# Altium schematic sheet PAGE 07-DIGITAL IO.SchDoc
size 416 x 264 mm; DocumentNumber: 7; SheetNumber: 7; PageSetup: Record=PageOptions|CenterHorizontal=True|CenterVertical=True|PrintScale=1.02|XCorrection=1.00|YCorrection=1.00|PrintKind=0|BorderSize=5000000|LeftOffset=0|BottomOffset=0|Orientation=2|PaperLength=1000|PaperWidth=1000|Scale=100|PaperSource=15|PrintQuality=600|MediaType=1|DitherType=10|PrintScaleMode=1|PaperKind=11x17|PaperIndex=17; Designer: Xuelu Li; DocumentFullPathAndName: //depot_np_hweng_boards/ung_hweng/UNG_8017_EVB-USB5926/
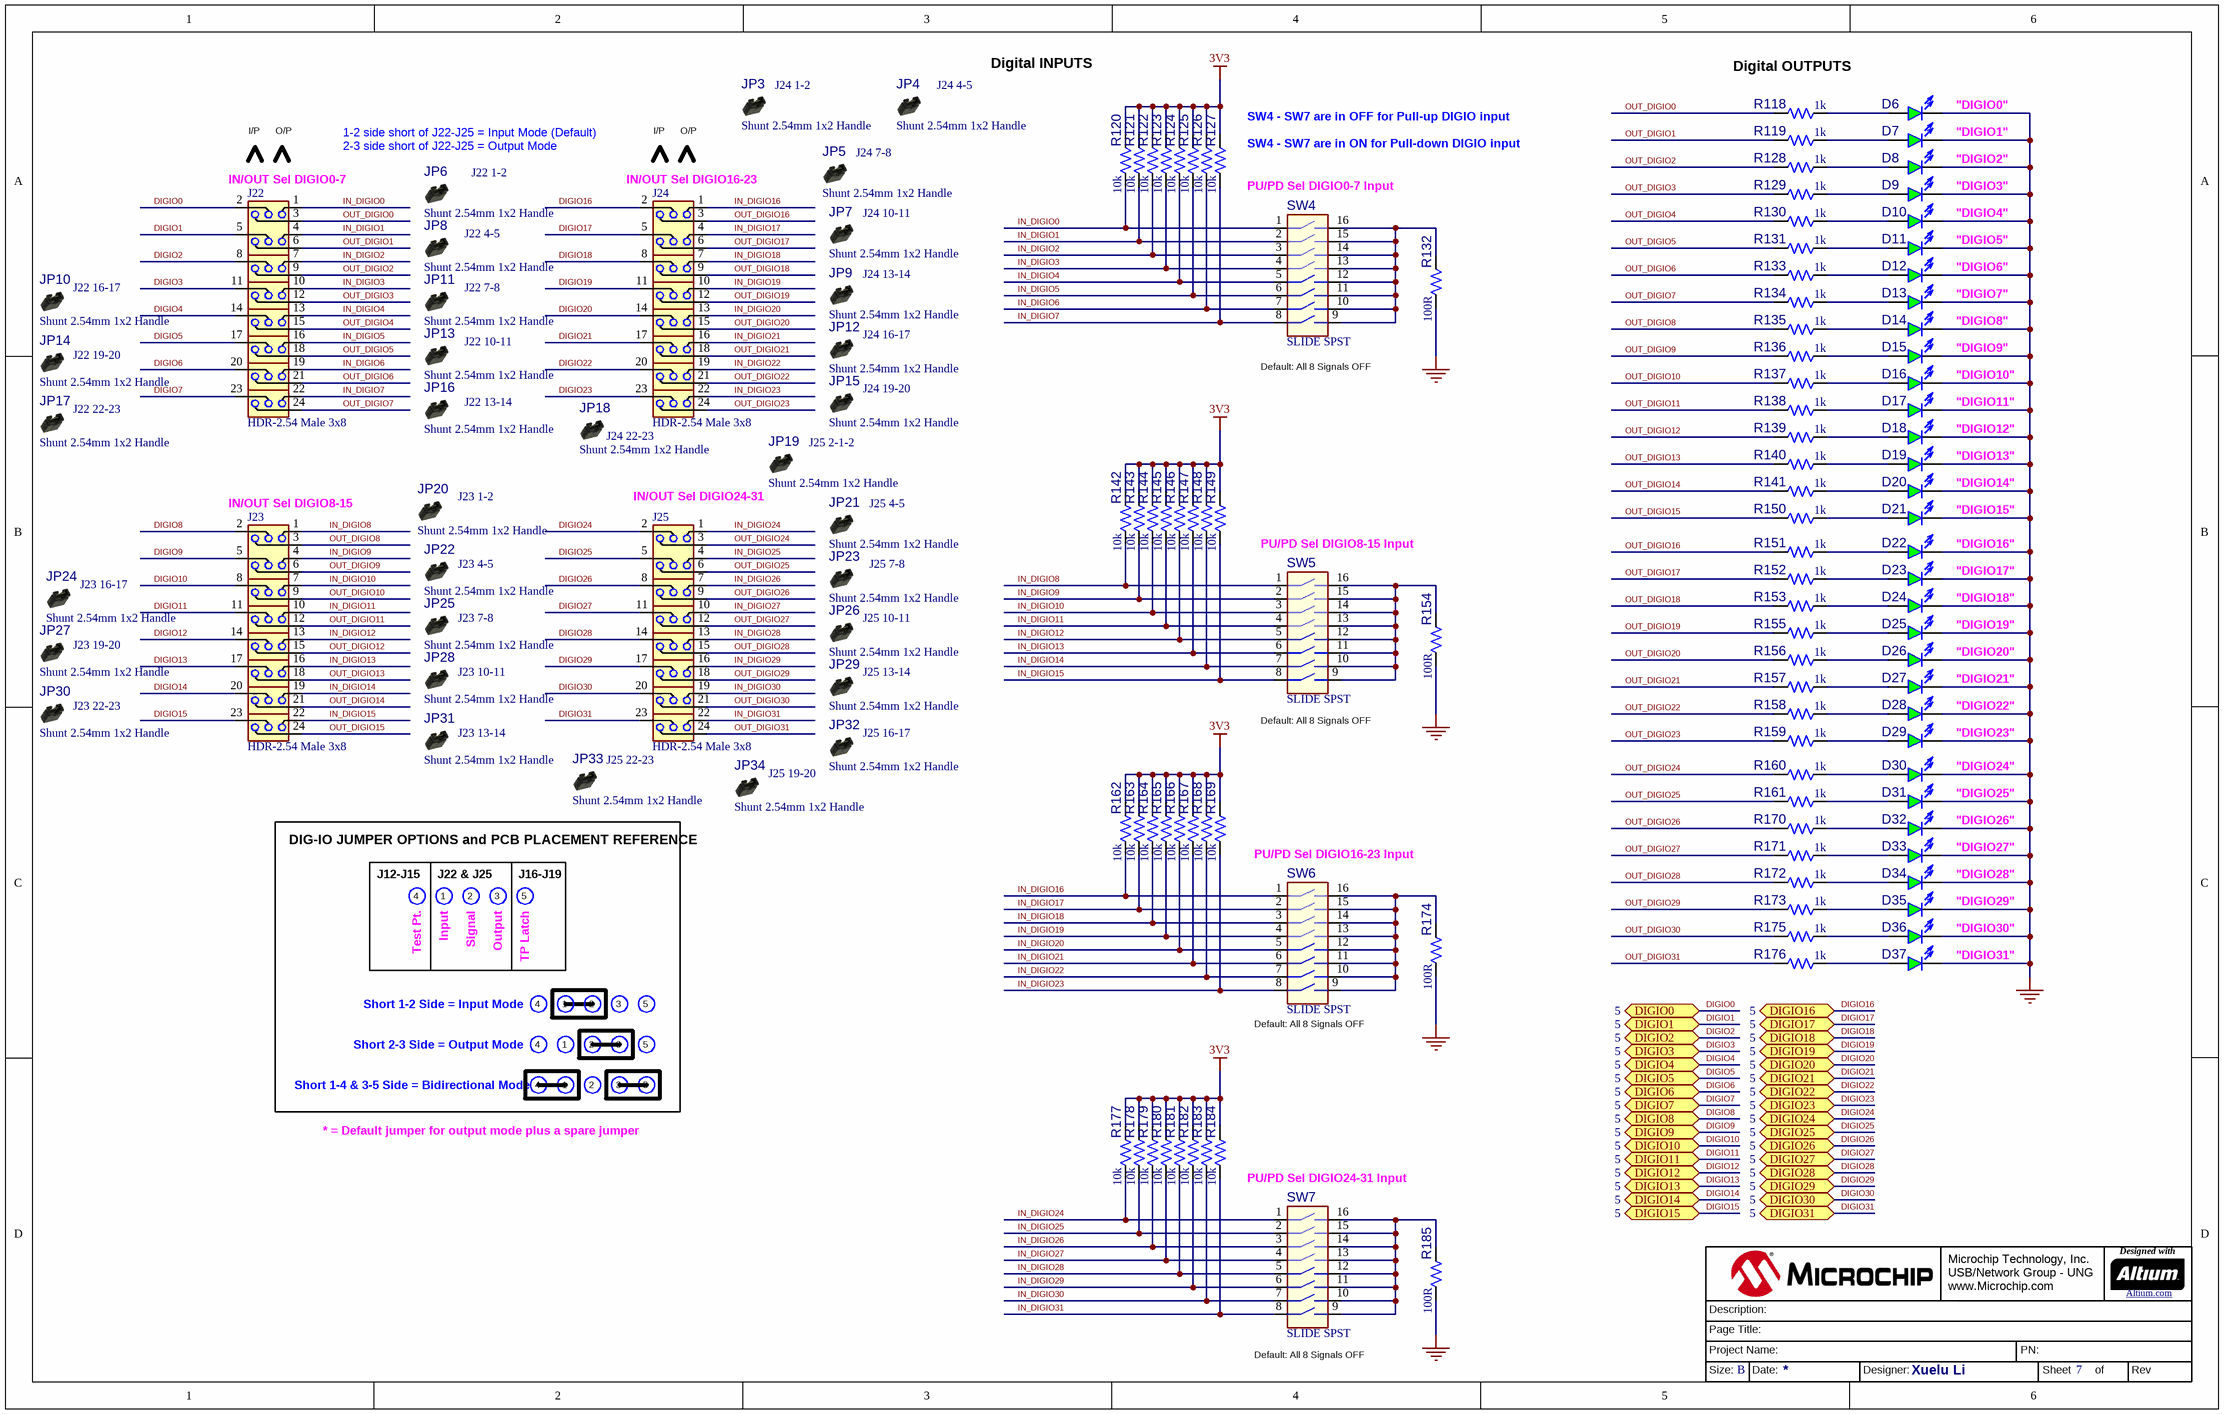
[diagram p0: PAGE 07-DIGITAL IO.SchDoc]

## Parts
?  (no value)  (graphical)
D6  LED_green  [LED_0603_GREEN]  (value not drawn)
D7  LED_green  [LED_0603_GREEN]  (value not drawn)
D8  LED_green  [LED_0603_GREEN]  (value not drawn)
D9  LED_green  [LED_0603_GREEN]  (value not drawn)
D10  LED_green  [LED_0603_GREEN]  (value not drawn)
D11  LED_green  [LED_0603_GREEN]  (value not drawn)
D12  LED_green  [LED_0603_GREEN]  (value not drawn)
D13  LED_green  [LED_0603_GREEN]  (value not drawn)
D14  LED_green  [LED_0603_GREEN]  (value not drawn)
D15  LED_green  [LED_0603_GREEN]  (value not drawn)
D16  LED_green  [LED_0603_GREEN]  (value not drawn)
D17  LED_green  [LED_0603_GREEN]  (value not drawn)
D18  LED_green  [LED_0603_GREEN]  (value not drawn)
D19  LED_green  [LED_0603_GREEN]  (value not drawn)
D20  LED_green  [LED_0603_GREEN]  (value not drawn)
D21  LED_green  [LED_0603_GREEN]  (value not drawn)
D22  LED_green  [LED_0603_GREEN]  (value not drawn)
D23  LED_green  [LED_0603_GREEN]  (value not drawn)
D24  LED_green  [LED_0603_GREEN]  (value not drawn)
D25  LED_green  [LED_0603_GREEN]  (value not drawn)
D26  LED_green  [LED_0603_GREEN]  (value not drawn)
D27  LED_green  [LED_0603_GREEN]  (value not drawn)
D28  LED_green  [LED_0603_GREEN]  (value not drawn)
D29  LED_green  [LED_0603_GREEN]  (value not drawn)
D30  LED_green  [LED_0603_GREEN]  (value not drawn)
D31  LED_green  [LED_0603_GREEN]  (value not drawn)
D32  LED_green  [LED_0603_GREEN]  (value not drawn)
D33  LED_green  [LED_0603_GREEN]  (value not drawn)
D34  LED_green  [LED_0603_GREEN]  (value not drawn)
D35  LED_green  [LED_0603_GREEN]  (value not drawn)
D36  LED_green  [LED_0603_GREEN]  (value not drawn)
D37  LED_green  [LED_0603_GREEN]  (value not drawn)
J22  value HDR-2.54 Male 3x8  [CON_HDR_2.54_3X8-shifted1]  (hidden comment: CON_HDR_2.54_3X8-shifted1)
J23  value HDR-2.54 Male 3x8  [CON_HDR_2.54_3X8-shifted1]  (hidden comment: CON_HDR_2.54_3X8-shifted1)
J24  value HDR-2.54 Male 3x8  [CON_HDR_2.54_3X8-shifted1]  (hidden comment: CON_HDR_2.54_3X8-shifted1)
J25  value HDR-2.54 Male 3x8  [CON_HDR_2.54_3X8-shifted1]  (hidden comment: CON_HDR_2.54_3X8-shifted1)
JP3  value Shunt 2.54mm 1x2 Handle  BOM Notes: J24 1-2  [Jumper_W_Handle_Mechanical]  (hidden comment: Jumper Mechanical)  (mechanical)
JP4  value Shunt 2.54mm 1x2 Handle  BOM Notes: J24 4-5  [Jumper_W_Handle_Mechanical]  (hidden comment: Jumper Mechanical)  (mechanical)
JP5  value Shunt 2.54mm 1x2 Handle  BOM Notes: J24 7-8  [Jumper_W_Handle_Mechanical]  (hidden comment: Jumper Mechanical)  (mechanical)
JP6  value Shunt 2.54mm 1x2 Handle  BOM Notes: J22 1-2  [Jumper_W_Handle_Mechanical]  (hidden comment: Jumper Mechanical)  (mechanical)
JP7  value Shunt 2.54mm 1x2 Handle  BOM Notes: J24 10-11  [Jumper_W_Handle_Mechanical]  (hidden comment: Jumper Mechanical)  (mechanical)
JP8  value Shunt 2.54mm 1x2 Handle  BOM Notes: J22 4-5  [Jumper_W_Handle_Mechanical]  (hidden comment: Jumper Mechanical)  (mechanical)
JP9  value Shunt 2.54mm 1x2 Handle  BOM Notes: J24 13-14  [Jumper_W_Handle_Mechanical]  (hidden comment: Jumper Mechanical)  (mechanical)
JP10  value Shunt 2.54mm 1x2 Handle  BOM Notes: J22 16-17  [Jumper_W_Handle_Mechanical]  (hidden comment: Jumper Mechanical)  (mechanical)
JP11  value Shunt 2.54mm 1x2 Handle  BOM Notes: J22 7-8  [Jumper_W_Handle_Mechanical]  (hidden comment: Jumper Mechanical)  (mechanical)
JP12  value Shunt 2.54mm 1x2 Handle  BOM Notes: J24 16-17  [Jumper_W_Handle_Mechanical]  (hidden comment: Jumper Mechanical)  (mechanical)
JP13  value Shunt 2.54mm 1x2 Handle  BOM Notes: J22 10-11  [Jumper_W_Handle_Mechanical]  (hidden comment: Jumper Mechanical)  (mechanical)
JP14  value Shunt 2.54mm 1x2 Handle  BOM Notes: J22 19-20  [Jumper_W_Handle_Mechanical]  (hidden comment: Jumper Mechanical)  (mechanical)
JP15  value Shunt 2.54mm 1x2 Handle  BOM Notes: J24 19-20  [Jumper_W_Handle_Mechanical]  (hidden comment: Jumper Mechanical)  (mechanical)
JP16  value Shunt 2.54mm 1x2 Handle  BOM Notes: J22 13-14  [Jumper_W_Handle_Mechanical]  (hidden comment: Jumper Mechanical)  (mechanical)
JP17  value Shunt 2.54mm 1x2 Handle  BOM Notes: J22 22-23  [Jumper_W_Handle_Mechanical]  (hidden comment: Jumper Mechanical)  (mechanical)
JP18  value Shunt 2.54mm 1x2 Handle  BOM Notes: J24 22-23  [Jumper_W_Handle_Mechanical]  (hidden comment: Jumper Mechanical)  (mechanical)
JP19  value Shunt 2.54mm 1x2 Handle  BOM Notes: J25 2-1-2  [Jumper_W_Handle_Mechanical]  (hidden comment: Jumper Mechanical)  (mechanical)
JP20  value Shunt 2.54mm 1x2 Handle  BOM Notes: J23 1-2  [Jumper_W_Handle_Mechanical]  (hidden comment: Jumper Mechanical)  (mechanical)
JP21  value Shunt 2.54mm 1x2 Handle  BOM Notes: J25 4-5  [Jumper_W_Handle_Mechanical]  (hidden comment: Jumper Mechanical)  (mechanical)
JP22  value Shunt 2.54mm 1x2 Handle  BOM Notes: J23 4-5  [Jumper_W_Handle_Mechanical]  (hidden comment: Jumper Mechanical)  (mechanical)
JP23  value Shunt 2.54mm 1x2 Handle  BOM Notes: J25 7-8  [Jumper_W_Handle_Mechanical]  (hidden comment: Jumper Mechanical)  (mechanical)
JP24  value Shunt 2.54mm 1x2 Handle  BOM Notes: J23 16-17  [Jumper_W_Handle_Mechanical]  (hidden comment: Jumper Mechanical)  (mechanical)
JP25  value Shunt 2.54mm 1x2 Handle  BOM Notes: J23 7-8  [Jumper_W_Handle_Mechanical]  (hidden comment: Jumper Mechanical)  (mechanical)
JP26  value Shunt 2.54mm 1x2 Handle  BOM Notes: J25 10-11  [Jumper_W_Handle_Mechanical]  (hidden comment: Jumper Mechanical)  (mechanical)
JP27  value Shunt 2.54mm 1x2 Handle  BOM Notes: J23 19-20  [Jumper_W_Handle_Mechanical]  (hidden comment: Jumper Mechanical)  (mechanical)
JP28  value Shunt 2.54mm 1x2 Handle  BOM Notes: J23 10-11  [Jumper_W_Handle_Mechanical]  (hidden comment: Jumper Mechanical)  (mechanical)
JP29  value Shunt 2.54mm 1x2 Handle  BOM Notes: J25 13-14  [Jumper_W_Handle_Mechanical]  (hidden comment: Jumper Mechanical)  (mechanical)
JP30  value Shunt 2.54mm 1x2 Handle  BOM Notes: J23 22-23  [Jumper_W_Handle_Mechanical]  (hidden comment: Jumper Mechanical)  (mechanical)
JP31  value Shunt 2.54mm 1x2 Handle  BOM Notes: J23 13-14  [Jumper_W_Handle_Mechanical]  (hidden comment: Jumper Mechanical)  (mechanical)
JP32  value Shunt 2.54mm 1x2 Handle  BOM Notes: J25 16-17  [Jumper_W_Handle_Mechanical]  (hidden comment: Jumper Mechanical)  (mechanical)
JP33  value Shunt 2.54mm 1x2 Handle  BOM Notes: J25 22-23  [Jumper_W_Handle_Mechanical]  (hidden comment: Jumper Mechanical)  (mechanical)
JP34  value Shunt 2.54mm 1x2 Handle  BOM Notes: J25 19-20  [Jumper_W_Handle_Mechanical]  (hidden comment: Jumper Mechanical)  (mechanical)
R118  value 1k  [RES_C_0603]  (hidden comment: Resistor)
R119  value 1k  [RES_C_0603]  (hidden comment: Resistor)
R120  value 10k  [RES_C_0603]  (hidden comment: Resistor)
R121  value 10k  [RES_C_0603]  (hidden comment: Resistor)
R122  value 10k  [RES_C_0603]  (hidden comment: Resistor)
R123  value 10k  [RES_C_0603]  (hidden comment: Resistor)
R124  value 10k  [RES_C_0603]  (hidden comment: Resistor)
R125  value 10k  [RES_C_0603]  (hidden comment: Resistor)
R126  value 10k  [RES_C_0603]  (hidden comment: Resistor)
R127  value 10k  [RES_C_0603]  (hidden comment: Resistor)
R128  value 1k  [RES_C_0603]  (hidden comment: Resistor)
R129  value 1k  [RES_C_0603]  (hidden comment: Resistor)
R130  value 1k  [RES_C_0603]  (hidden comment: Resistor)
R131  value 1k  [RES_C_0603]  (hidden comment: Resistor)
R132  value 100R  [RES_C_0603]  (hidden comment: Resistor)
R133  value 1k  [RES_C_0603]  (hidden comment: Resistor)
R134  value 1k  [RES_C_0603]  (hidden comment: Resistor)
R135  value 1k  [RES_C_0603]  (hidden comment: Resistor)
R136  value 1k  [RES_C_0603]  (hidden comment: Resistor)
R137  value 1k  [RES_C_0603]  (hidden comment: Resistor)
R138  value 1k  [RES_C_0603]  (hidden comment: Resistor)
R139  value 1k  [RES_C_0603]  (hidden comment: Resistor)
R140  value 1k  [RES_C_0603]  (hidden comment: Resistor)
R141  value 1k  [RES_C_0603]  (hidden comment: Resistor)
R142  value 10k  [RES_C_0603]  (hidden comment: Resistor)
R143  value 10k  [RES_C_0603]  (hidden comment: Resistor)
R144  value 10k  [RES_C_0603]  (hidden comment: Resistor)
R145  value 10k  [RES_C_0603]  (hidden comment: Resistor)
R146  value 10k  [RES_C_0603]  (hidden comment: Resistor)
R147  value 10k  [RES_C_0603]  (hidden comment: Resistor)
R148  value 10k  [RES_C_0603]  (hidden comment: Resistor)
R149  value 10k  [RES_C_0603]  (hidden comment: Resistor)
R150  value 1k  [RES_C_0603]  (hidden comment: Resistor)
R151  value 1k  [RES_C_0603]  (hidden comment: Resistor)
R152  value 1k  [RES_C_0603]  (hidden comment: Resistor)
R153  value 1k  [RES_C_0603]  (hidden comment: Resistor)
R154  value 100R  [RES_C_0603]  (hidden comment: Resistor)
R155  value 1k  [RES_C_0603]  (hidden comment: Resistor)
R156  value 1k  [RES_C_0603]  (hidden comment: Resistor)
R157  value 1k  [RES_C_0603]  (hidden comment: Resistor)
R158  value 1k  [RES_C_0603]  (hidden comment: Resistor)
R159  value 1k  [RES_C_0603]  (hidden comment: Resistor)
R160  value 1k  [RES_C_0603]  (hidden comment: Resistor)
R161  value 1k  [RES_C_0603]  (hidden comment: Resistor)
R162  value 10k  [RES_C_0603]  (hidden comment: Resistor)
R163  value 10k  [RES_C_0603]  (hidden comment: Resistor)
R164  value 10k  [RES_C_0603]  (hidden comment: Resistor)
R165  value 10k  [RES_C_0603]  (hidden comment: Resistor)
R166  value 10k  [RES_C_0603]  (hidden comment: Resistor)
R167  value 10k  [RES_C_0603]  (hidden comment: Resistor)
R168  value 10k  [RES_C_0603]  (hidden comment: Resistor)
R169  value 10k  [RES_C_0603]  (hidden comment: Resistor)
R170  value 1k  [RES_C_0603]  (hidden comment: Resistor)
R171  value 1k  [RES_C_0603]  (hidden comment: Resistor)
R172  value 1k  [RES_C_0603]  (hidden comment: Resistor)
R173  value 1k  [RES_C_0603]  (hidden comment: Resistor)
R174  value 100R  [RES_C_0603]  (hidden comment: Resistor)
R175  value 1k  [RES_C_0603]  (hidden comment: Resistor)
R176  value 1k  [RES_C_0603]  (hidden comment: Resistor)
R177  value 10k  [RES_C_0603]  (hidden comment: Resistor)
R178  value 10k  [RES_C_0603]  (hidden comment: Resistor)
R179  value 10k  [RES_C_0603]  (hidden comment: Resistor)
R180  value 10k  [RES_C_0603]  (hidden comment: Resistor)
R181  value 10k  [RES_C_0603]  (hidden comment: Resistor)
R182  value 10k  [RES_C_0603]  (hidden comment: Resistor)
R183  value 10k  [RES_C_0603]  (hidden comment: Resistor)
R184  value 10k  [RES_C_0603]  (hidden comment: Resistor)
R185  value 100R  [RES_C_0603]  (hidden comment: Resistor)
SW4  value SLIDE SPST  [SW_SLIDE_SMD_TE_1-1825058-9]  (hidden comment: SWITCH DIP 8 SPST)
SW5  value SLIDE SPST  [SW_SLIDE_SMD_TE_1-1825058-9]  (hidden comment: SWITCH DIP 8 SPST)
SW6  value SLIDE SPST  [SW_SLIDE_SMD_TE_1-1825058-9]  (hidden comment: SWITCH DIP 8 SPST)
SW7  value SLIDE SPST  [SW_SLIDE_SMD_TE_1-1825058-9]  (hidden comment: SWITCH DIP 8 SPST)

## Ports
DIGIO0 (bidir, see 5), DIGIO1 (bidir, see 5), DIGIO2 (bidir, see 5), DIGIO3 (bidir, see 5), DIGIO4 (bidir, see 5), DIGIO5 (bidir, see 5), DIGIO6 (bidir, see 5), DIGIO7 (bidir, see 5), DIGIO8 (bidir, see 5), DIGIO9 (bidir, see 5), DIGIO10 (bidir, see 5), DIGIO11 (bidir, see 5), DIGIO12 (bidir, see 5), DIGIO13 (bidir, see 5), DIGIO14 (bidir, see 5), DIGIO15 (bidir, see 5), DIGIO16 (bidir, see 5), DIGIO17 (bidir, see 5), DIGIO18 (bidir, see 5), DIGIO19 (bidir, see 5), DIGIO20 (bidir, see 5), DIGIO21 (bidir, see 5), DIGIO22 (bidir, see 5), DIGIO23 (bidir, see 5), DIGIO24 (bidir, see 5), DIGIO25 (bidir, see 5), DIGIO26 (bidir, see 5), DIGIO27 (bidir, see 5), DIGIO28 (bidir, see 5), DIGIO29 (bidir, see 5), DIGIO30 (bidir, see 5), DIGIO31 (bidir, see 5)

## Nets
3V3: R120.2 R121.2 R122.2 R123.2 R124.2 R125.2 R126.2 R127.2 R142.2 R143.2 R144.2 R145.2 R146.2 R147.2 R148.2 R149.2 R162.2 R163.2 R164.2 R165.2 R166.2 R167.2 R168.2 R169.2 R177.2 R178.2 R179.2 R180.2 R181.2 R182.2 R183.2 R184.2
GND: D6.2(K) D7.2(K) D8.2(K) D9.2(K) D10.2(K) D11.2(K) D12.2(K) D13.2(K) D14.2(K) D15.2(K) D16.2(K) D17.2(K) D18.2(K) D19.2(K) D20.2(K) D21.2(K) D22.2(K) D23.2(K) D24.2(K) D25.2(K) D26.2(K) D27.2(K) D28.2(K) D29.2(K) D30.2(K) D31.2(K) D32.2(K) D33.2(K) D34.2(K) D35.2(K) D36.2(K) D37.2(K) R132.1 R154.1 R174.1 R185.1
DIGIO0: J22.2(P2) ; port DIGIO0
DIGIO1: J22.5(P5) ; port DIGIO1
DIGIO2: J22.8(P8) ; port DIGIO2
DIGIO3: J22.11(P11) ; port DIGIO3
DIGIO4: J22.14(P14) ; port DIGIO4
DIGIO5: J22.17(P17) ; port DIGIO5
DIGIO6: J22.20(P20) ; port DIGIO6
DIGIO7: J22.23(P23) ; port DIGIO7
DIGIO8: J23.2(P2) ; port DIGIO8
DIGIO9: J23.5(P5) ; port DIGIO9
DIGIO10: J23.8(P8) ; port DIGIO10
DIGIO11: J23.11(P11) ; port DIGIO11
DIGIO12: J23.14(P14) ; port DIGIO12
DIGIO13: J23.17(P17) ; port DIGIO13
DIGIO14: J23.20(P20) ; port DIGIO14
DIGIO15: J23.23(P23) ; port DIGIO15
DIGIO16: J24.2(P2) ; port DIGIO16
DIGIO17: J24.5(P5) ; port DIGIO17
DIGIO18: J24.8(P8) ; port DIGIO18
DIGIO19: J24.11(P11) ; port DIGIO19
DIGIO20: J24.14(P14) ; port DIGIO20
DIGIO21: J24.17(P17) ; port DIGIO21
DIGIO22: J24.20(P20) ; port DIGIO22
DIGIO23: J24.23(P23) ; port DIGIO23
DIGIO24: J25.2(P2) ; port DIGIO24
DIGIO25: J25.5(P5) ; port DIGIO25
DIGIO26: J25.8(P8) ; port DIGIO26
DIGIO27: J25.11(P11) ; port DIGIO27
DIGIO28: J25.14(P14) ; port DIGIO28
DIGIO29: J25.17(P17) ; port DIGIO29
DIGIO30: J25.20(P20) ; port DIGIO30
DIGIO31: J25.23(P23) ; port DIGIO31
IN_DIGIO0: J22.1(P1) R120.1 SW4.1
IN_DIGIO1: J22.4(P4) R121.1 SW4.2
IN_DIGIO2: J22.7(P7) R122.1 SW4.3
IN_DIGIO3: J22.10(P10) R123.1 SW4.4
IN_DIGIO4: J22.13(P13) R124.1 SW4.5
IN_DIGIO5: J22.16(P16) R125.1 SW4.6
IN_DIGIO6: J22.19(P19) R126.1 SW4.7
IN_DIGIO7: J22.22(P22) R127.1 SW4.8
IN_DIGIO8: J23.1(P1) R142.1 SW5.1
IN_DIGIO9: J23.4(P4) R143.1 SW5.2
IN_DIGIO10: J23.7(P7) R144.1 SW5.3
IN_DIGIO11: J23.10(P10) R145.1 SW5.4
IN_DIGIO12: J23.13(P13) R146.1 SW5.5
IN_DIGIO13: J23.16(P16) R147.1 SW5.6
IN_DIGIO14: J23.19(P19) R148.1 SW5.7
IN_DIGIO15: J23.22(P22) R149.1 SW5.8
IN_DIGIO16: J24.1(P1) R162.1 SW6.1
IN_DIGIO17: J24.4(P4) R163.1 SW6.2
IN_DIGIO18: J24.7(P7) R164.1 SW6.3
IN_DIGIO19: J24.10(P10) R165.1 SW6.4
IN_DIGIO20: J24.13(P13) R166.1 SW6.5
IN_DIGIO21: J24.16(P16) R167.1 SW6.6
IN_DIGIO22: J24.19(P19) R168.1 SW6.7
IN_DIGIO23: J24.22(P22) R169.1 SW6.8
IN_DIGIO24: J25.1(P1) R177.1 SW7.1
IN_DIGIO25: J25.4(P4) R178.1 SW7.2
IN_DIGIO26: J25.7(P7) R179.1 SW7.3
IN_DIGIO27: J25.10(P10) R180.1 SW7.4
IN_DIGIO28: J25.13(P13) R181.1 SW7.5
IN_DIGIO29: J25.16(P16) R182.1 SW7.6
IN_DIGIO30: J25.19(P19) R183.1 SW7.7
IN_DIGIO31: J25.22(P22) R184.1 SW7.8
OUT_DIGIO0: J22.3 R118.1
OUT_DIGIO1: J22.6(P6) R119.1
OUT_DIGIO2: J22.9(P9) R128.1
OUT_DIGIO3: J22.12(P12) R129.1
OUT_DIGIO4: J22.15(P15) R130.1
OUT_DIGIO5: J22.18(P18) R131.1
OUT_DIGIO6: J22.21(P21) R133.1
OUT_DIGIO7: J22.24(P24) R134.1
OUT_DIGIO8: J23.3 R135.1
OUT_DIGIO9: J23.6(P6) R136.1
OUT_DIGIO10: J23.9(P9) R137.1
OUT_DIGIO11: J23.12(P12) R138.1
OUT_DIGIO12: J23.15(P15) R139.1
OUT_DIGIO13: J23.18(P18) R140.1
OUT_DIGIO14: J23.21(P21) R141.1
OUT_DIGIO15: J23.24(P24) R150.1
OUT_DIGIO16: J24.3 R151.1
OUT_DIGIO17: J24.6(P6) R152.1
OUT_DIGIO18: J24.9(P9) R153.1
OUT_DIGIO19: J24.12(P12) R155.1
OUT_DIGIO20: J24.15(P15) R156.1
OUT_DIGIO21: J24.18(P18) R157.1
OUT_DIGIO22: J24.21(P21) R158.1
OUT_DIGIO23: J24.24(P24) R159.1
OUT_DIGIO24: J25.3 R160.1
OUT_DIGIO25: J25.6(P6) R161.1
OUT_DIGIO26: J25.9(P9) R170.1
OUT_DIGIO27: J25.12(P12) R171.1
OUT_DIGIO28: J25.15(P15) R172.1
OUT_DIGIO29: J25.18(P18) R173.1
OUT_DIGIO30: J25.21(P21) R175.1
OUT_DIGIO31: J25.24(P24) R176.1
NetD6_1: D6.1(A) R118.2
NetD7_1: D7.1(A) R119.2
NetD8_1: D8.1(A) R128.2
NetD9_1: D9.1(A) R129.2
NetD10_1: D10.1(A) R130.2
NetD11_1: D11.1(A) R131.2
NetD12_1: D12.1(A) R133.2
NetD13_1: D13.1(A) R134.2
NetD14_1: D14.1(A) R135.2
NetD15_1: D15.1(A) R136.2
NetD16_1: D16.1(A) R137.2
NetD17_1: D17.1(A) R138.2
NetD18_1: D18.1(A) R139.2
NetD19_1: D19.1(A) R140.2
NetD20_1: D20.1(A) R141.2
NetD21_1: D21.1(A) R150.2
NetD22_1: D22.1(A) R151.2
NetD23_1: D23.1(A) R152.2
NetD24_1: D24.1(A) R153.2
NetD25_1: D25.1(A) R155.2
NetD26_1: D26.1(A) R156.2
NetD27_1: D27.1(A) R157.2
NetD28_1: D28.1(A) R158.2
NetD29_1: D29.1(A) R159.2
NetD30_1: D30.1(A) R160.2
NetD31_1: D31.1(A) R161.2
NetD32_1: D32.1(A) R170.2
NetD33_1: D33.1(A) R171.2
NetD34_1: D34.1(A) R172.2
NetD35_1: D35.1(A) R173.2
NetD36_1: D36.1(A) R175.2
NetD37_1: D37.1(A) R176.2
NetR132_2: R132.2 SW4.9 SW4.10 SW4.11 SW4.12 SW4.13 SW4.14 SW4.15 SW4.16
NetR154_2: R154.2 SW5.9 SW5.10 SW5.11 SW5.12 SW5.13 SW5.14 SW5.15 SW5.16
NetR174_2: R174.2 SW6.9 SW6.10 SW6.11 SW6.12 SW6.13 SW6.14 SW6.15 SW6.16
NetR185_2: R185.2 SW7.9 SW7.10 SW7.11 SW7.12 SW7.13 SW7.14 SW7.15 SW7.16

## Notes on the sheet
- Digital INPUTS
- (near R118) Digital OUTPUTS
- I/P
- O/P
- (near JP6) 1-2 side short of J22-J25 = Input Mode (Default)
  2-3 side short of J22-J25 = Output Mode
- SW4 - SW7 are in OFF for Pull-up DIGIO input
  SW4 - SW7 are in ON for Pull-down DIGIO input
- "DIGIO0"
- "DIGIO1"
- (near J22) IN/OUT Sel DIGIO0-7
- (near J24) IN/OUT Sel DIGIO16-23
- PU/PD Sel DIGIO0-7 Input
- "DIGIO2"
- "DIGIO3"
- "DIGIO4"
- "DIGIO5"
- "DIGIO6"
- "DIGIO7"
- "DIGIO8"
- "DIGIO9"
- (near SW4) Default: All 8 Signals OFF
- "DIGIO10"
- "DIGIO11"
- "DIGIO12"
- "DIGIO13"
- "DIGIO14"
- (near J23) IN/OUT Sel DIGIO8-15
- IN/OUT Sel DIGIO24-31
- PU/PD Sel DIGIO8-15 Input
- "DIGIO15"
- "DIGIO16"
- "DIGIO17"
- "DIGIO18"
- "DIGIO19"
- "DIGIO20"
- "DIGIO21"
- (near SW5) Default: All 8 Signals OFF
- "DIGIO22"
- "DIGIO23"
- "DIGIO24"
- "DIGIO25"
- "DIGIO26"
- DIG-IO JUMPER OPTIONS and PCB PLACEMENT REFERENCE
- J12-J15
- 4
- J22 & J25
- 1
- 2
- 3
- J16-J19
- 5
- PU/PD Sel DIGIO16-23 Input
- "DIGIO27"
- "DIGIO28"
- Test Pt.
- Input
- Signal
- Output
- TP Latch
- "DIGIO29"
- "DIGIO30"
- "DIGIO31"
- Short 1-2 Side = Input Mode
- (near SW6) Default: All 8 Signals OFF
- Short 2-3 Side = Output Mode
- Short 1-4 & 3-5 Side = Bidirectional Mode
- * = Default jumper for output mode plus a spare jumper
- PU/PD Sel DIGIO24-31 Input
- (near SW7) Default: All 8 Signals OFF
- Microchip Technology, Inc.
  USB/Network Group - UNG
  www.Microchip.com
- Designed with
- Altium.com <http://go.altium.com/MicrochipLandingPage_Evaluation.html>
- Page Title:
- Project Name:
- Description:
- PN:
- Size:
- B
- Date:
- Designer:
- Sheet
- of
- Rev

## Library data of the parts
? = Title Block B_UNG1_Altium
D6-D37 = DIODE1155: LED; Manufacturer 1: Lite-On Inc; Manufacturer Part Number 1: LTST-C191KGKT; Value: GREEN; Description_: DIO LED GREEN 2V 30mA 35mcd Clear SMD 0603; Dev Tools Status: Production; Type: LED Single; Forward Current: 30mA; Power: 75mW; Reverse Voltage: 5V; Owner: Tad Ahlvers; Populated: YES; MCHP-ID: DIODE1155; Revision: 1; Symbol: LED_green; Status: MCL Design; ComponentLink1URL: https://chn-vm-apps.microchip.com/mchprepo/parts/Datasheets/S_110_LTST-C191KGKT.pdf; ComponentLink1Description: SVN Datasheet; ComponentLink2URL: C:\ALTIUM_WORK\00001_MCHP-CDB\Datasheets\S_110_LTST-C191KGKT.pdf; ComponentLink2Description: Local Datasheet; ComponentLink3URL: C:\ALTIUM_WORK\00001_MCHP-CDB\Library\LibraryRefs\LED_green.SchLib; ComponentLink3Description: Open Symbol; ComponentLink4URL: C:\ALTIUM_WORK\00001_MCHP-CDB\Library\Footprints\LED_0603_GREEN.PcbLib; ComponentLink4Description: Open Footprint; ComponentLink5Description: Open Footprint 2; ComponentLink6Description: Open Footprint 3; ComponentLink7Description: Open Footprint 4; Operating Temperature: -55C to +85C; Category: Diode; Manufacturer 2: Ledtech; Manufacturer Part Number 2: LT8A23-54-SB96-T5; Supplier 1: Digi-Key; Supplier Part Number 1: 160-1446-1-ND; Supplier 2: Raynen; Supplier Part Number 2: LEDD00036B01; Quantity Override: 1
J22-J25 = CON2009: Manufacturer 1: Samtec Inc.; Manufacturer Part Number 1: TSW-108-07-G-T; Description_: CON HDR 2.54 Male 3X8 Au 5.84MH TH VERT; Dev Tools Status: Design; Owner: Sam Charles; Populated: YES; ComponentLink1URL: https://chn-vm-apps.microchip.com/mchprepo/parts/Datasheets/tsw-xxx-xx-xxx-x-xx-xxx-mkt.pdf; MCHP-ID: CON2009; Revision: 1; Symbol: Header 3x8; Status: MCL Design; ComponentLink1Description: SVN Datasheet; ComponentLink2URL: C:\ALTIUM_WORK\00001_MCHP-CDB\Datasheets\tsw-xxx-xx-xxx-x-xx-xxx-mkt.pdf; ComponentLink2Description: Local Datasheet; ComponentLink3URL: C:\ALTIUM_WORK\00001_MCHP-CDB\Library\LibraryRefs\Header 3x8.SchLib; ComponentLink3Description: Open Symbol; ComponentLink4URL: C:\ALTIUM_WORK\00001_MCHP-CDB\Library\Footprints\CON_HDR_2.54_3X8.PcbLib; ComponentLink4Description: Open Footprint; ComponentLink5Description: Open Footprint 2; ComponentLink6Description: Open Footprint 3; ComponentLink7Description: Open Footprint 4; Type: Header 2.54mm; Category: Connector; Supplier 1: Digi-Key; Supplier Part Number 1: SAM10855-ND; Quantity Override: 1
JP3-JP34 = HW1100: Manufacturer 1: TE Connectivity; Manufacturer Part Number 1: 881545-2; MCHP-ID: HW1100; Description_: MECH HW JUMPER 2.54mm 1x2 Handle Gold; Dev Tools Status: Production; Populated: MECH; Revision: 0; Symbol: Jumper Mechanical; Status: MCL Design; ComponentLink1URL: https://chn-vm-apps.microchip.com/mchprepo/parts/Datasheets/ENG_CD_881545_K3.pdf; ComponentLink1Description: SVN Datasheet; ComponentLink2URL: C:\ALTIUM_WORK\00001_MCHP-CDB\Datasheets\ENG_CD_881545_K3.pdf; ComponentLink2Description: Local Datasheet; ComponentLink3URL: C:\ALTIUM_WORK\00001_MCHP-CDB\Library\LibraryRefs\Jumper Mechanical.SchLib; ComponentLink3Description: Open Symbol; ComponentLink4URL: C:\ALTIUM_WORK\00001_MCHP-CDB\Library\Footprints\Jumper_W_Handle_Mechanical.PcbLib; ComponentLink4Description: Open Footprint; ComponentLink5Description: Open Footprint 2; ComponentLink6Description: Open Footprint 3; ComponentLink7Description: Open Footprint 4; Type: Jumper; Category: Hardware; Manufacturer 2: WCON; Manufacturer Part Number 2: 3730-1301OS0B01; Supplier 1: Digi-Key; Supplier Part Number 1: A26242-ND; Supplier 2: Raynen; Supplier Part Number 2: CONN00060D01M; Quantity Override: 1
R118 R119 R128-R131 R133-R141 R150-R153 R155-R161 R170-R173 R175 R176 = RES1128: Manufacturer 1: Panasonic; Manufacturer Part Number 1: ERJ-3GEYJ102V; Tolerance: 5%; Description_: RES TKF 1k 5% 1/10W SMD 0603; Dev Tools Status: Production; Voltage: 75V; Temperature Coeffcient: 200ppm/C; Power: 1/10W; Owner: Bogdan P (M91398); Populated: Yes; MCHP-ID: RES1128; Package: 0603; Revision: 0; Symbol: Resistor; Status: MCL Design; ComponentLink1URL: https://chn-vm-apps.microchip.com/mchprepo/parts/Datasheets/AOA0000CE1.pdf; ComponentLink1Description: SVN Datasheet; ComponentLink2URL: C:\ALTIUM_WORK\00001_MCHP-CDB\Datasheets\AOA0000CE1.pdf; ComponentLink2Description: Local Datasheet; ComponentLink3URL: C:\ALTIUM_WORK\00001_MCHP-CDB\Library\LibraryRefs\Resistor.SchLib; ComponentLink3Description: Open Symbol; ComponentLink4URL: C:\ALTIUM_WORK\00001_MCHP-CDB\Library\Footprints\RES_C_0603.PcbLib; ComponentLink4Description: Open Footprint; ComponentLink5Description: Open Footprint 2; ComponentLink6Description: Open Footprint 3; ComponentLink7Description: Open Footprint 4; Operating Temperature: -55C to +155C; Category: Resistor; Type: RES SMD; Composition: TKF; Supplier 1: Digi-Key; Supplier Part Number 1: P1.0KGCT-ND; Quantity Override: 1
R120-R127 R142-R149 R162-R169 R177-R184 = RES0191: Manufacturer 1: Panasonic; Manufacturer Part Number 1: ERJ-3GEYJ103V; Tolerance: 5%; Description_: RES TKF 10k 5% 1/10W SMD 0603; Dev Tools Status: Production; Voltage: 75V; Temperature Coeffcient: 200ppm/C; Power: 1/10W; Populated: Yes; MCHP-ID: RES0191; Package: 0603; Revision: 2; Symbol: Resistor; Status: MCL Design; ComponentLink1URL: https://chn-vm-apps.microchip.com/mchprepo/parts/Datasheets/AOA0000CE1.pdf; ComponentLink1Description: SVN Datasheet; ComponentLink2URL: C:\ALTIUM_WORK\00001_MCHP-CDB\Datasheets\AOA0000CE1.pdf; ComponentLink2Description: Local Datasheet; ComponentLink3URL: C:\ALTIUM_WORK\00001_MCHP-CDB\Library\LibraryRefs\Resistor.SchLib; ComponentLink3Description: Open Symbol; ComponentLink4URL: C:\ALTIUM_WORK\00001_MCHP-CDB\Library\Footprints\RES_C_0603.PcbLib; ComponentLink4Description: Open Footprint; ComponentLink5Description: Open Footprint 2; ComponentLink6Description: Open Footprint 3; ComponentLink7Description: Open Footprint 4; Operating Temperature: -55C to +155C; Category: Resistor; Type: RES SMD; Composition: TKF; Manufacturer 2: Yageo; Manufacturer Part Number 2: RC0603JR-0710KL; Manufacturer 3: NIC Components; Manufacturer Part Number 3: NRC06J103TRF; Supplier 1: Digi-Key; Supplier Part Number 1: P10KGCT-ND; Supplier 2: Digi-Key; Supplier Part Number 2: P10KGTR-ND; Supplier 3: Digi-Key; Supplier Part Number 3: 311-10KGRTR-ND; Supplier 4: NIC Components; Supplier Part Number 4: NRC06J103TRF; Quantity Override: 1
R132 R154 R174 R185 = RES0193: Manufacturer 1: Vishay; Manufacturer Part Number 1: CRCW0603100RJNEA; Tolerance: 5%; Description_: RES TKF 100R 5% 1/10W SMD 0603; Dev Tools Status: Production; Voltage: 50V; Temperature Coeffcient: 100ppm/C; Power: 1/10W; Populated: Yes; MCHP-ID: RES0193; Package: 0603; Revision: 1; Symbol: Resistor; Status: MCL Design; ComponentLink1URL: https://chn-vm-apps.microchip.com/mchprepo/parts/Datasheets/mcr_a.pdf; ComponentLink1Description: SVN Datasheet; ComponentLink2URL: C:\ALTIUM_WORK\00001_MCHP-CDB\Datasheets\mcr_a.pdf; ComponentLink2Description: Local Datasheet; ComponentLink3URL: C:\ALTIUM_WORK\00001_MCHP-CDB\Library\LibraryRefs\Resistor.SchLib; ComponentLink3Description: Open Symbol; ComponentLink4URL: C:\ALTIUM_WORK\00001_MCHP-CDB\Library\Footprints\RES_C_0603.PcbLib; ComponentLink4Description: Open Footprint; ComponentLink5Description: Open Footprint 2; ComponentLink6Description: Open Footprint 3; ComponentLink7Description: Open Footprint 4; Operating Temperature: -55C to +155C; Category: Resistor; Type: RES SMD; Composition: TKF; Manufacturer 2: ROHM; Manufacturer Part Number 2: MCR03EZPJ101; Supplier 1: Digi-Key; Supplier Part Number 1: 541-100GCT-ND; Supplier 2: Digi-Key; Supplier Part Number 2: RHM100GCT-ND; Quantity Override: 1
SW4-SW7 = SWITCH1076: Manufacturer 1: TE Connectivity Alcoswitch Switches; Manufacturer Part Number 1: 1-1825058-9; Description_: Dip Switch SPST 8 Position Surface Mount Slide (Standard) Actuator 100mA 24VDC; Dev Tools Status: Production; Owner: Sam Charles; Voltage: 24V; Current: 100mA; Populated: YES; Revision: 1; MCHP-ID: SWITCH1076; Symbol: SWITCH DIP 8 SPST; Status: MCL Design; ComponentLink1URL: https://chn-vm-apps.microchip.com/mchprepo/parts/Datasheets/ENG_CD_1825058_S2.pdf; ComponentLink1Description: SVN Datasheet; ComponentLink2URL: C:\ALTIUM_WORK\00001_MCHP-CDB\Datasheets\ENG_CD_1825058_S2.pdf; ComponentLink2Description: Local Datasheet; ComponentLink3URL: C:\ALTIUM_WORK\00001_MCHP-CDB\Library\LibraryRefs\SWITCH DIP 8 SPST.SchLib; ComponentLink3Description: Open Symbol; ComponentLink4URL: C:\ALTIUM_WORK\00001_MCHP-CDB\Library\Footprints\SW_SLIDE_SMD_TE_1-1825058-9.PcbLib; ComponentLink4Description: Open Footprint; ComponentLink5Description: Open Footprint 2; ComponentLink6Description: Open Footprint 3; ComponentLink7Description: Open Footprint 4; Operating Temperature: -30°C ~ 85°C; Category: Switch; Supplier 1: Digi-Key; Supplier Part Number 1: 1-1825058-9-ND; Quantity Override: 1